# EAGLE schematic teensy (EAGLE 9.6.2)
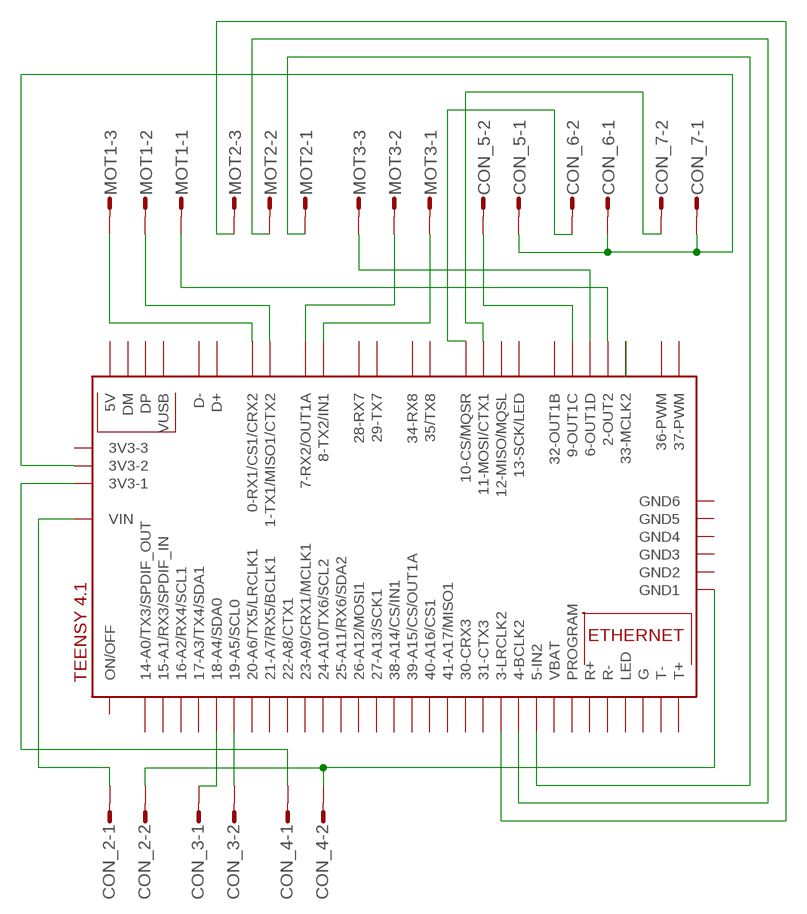
[diagram p0: schematic, sheet 1]

## Parts
CON_2  S02P  [S02P]
CON_3  S02P  [S02P]
CON_4  S02P  [S02P]
CON_5  S02P  [S02P]
CON_6  S02P  [S02P]
CON_7  S02P  [S02P]
MOT1  S03P  [S03P]
MOT2  S03P  [S03P]
MOT3  S03P  [S03P]
U$1  TEENSY41  [TEENSY41]

## Nets
N$1: U$1.33-MCLK2
N$2: CON_2.1 U$1.VIN
N$3: CON_4.1 U$1.3V3-1
N$4: CON_2.2 CON_4.2 U$1.GND1
N$5: CON_5.1 CON_6.1 CON_7.1 U$1.3V3-2
N$6: MOT1.3 U$1.0-RX1/CS1/CRX2
N$7: MOT1.2 U$1.1-TX1/MISO1/CTX2
N$8: MOT1.1 U$1.2-OUT2
N$9: MOT3.2 U$1.7-RX2/OUT1A
N$10: MOT3.1 U$1.8-TX2/IN1
N$11: CON_3.1 U$1.18-A4/SDA0
N$12: CON_3.2 U$1.19-A5/SCL0
N$13: MOT3.3 U$1.6-OUT1D
N$14: CON_5.2 U$1.9-OUT1C
N$15: CON_6.2 U$1.10-CS\MQSR(10-CS/MQSR)
N$16: CON_7.2 U$1.11-MOSI/CTX1
N$17: MOT2.3 U$1.3-LRCLK2
N$18: MOT2.2 U$1.4-BCLK2
N$19: MOT2.1 U$1.5-IN2
Unconnected: U$1.3V3-3 U$1.12-MISO/MQSL U$1.13-SCK/LED U$1.14-A0/TX3/SPDIF_OUT U$1.15-A1/RX3/SPDIF_IN U$1.16-A2/RX4/SCL1 U$1.17-A3/TX4/SDA1 U$1.20-A6/TX5/LRCLK1 U$1.21-A7/RX5/BCLK1 U$1.22-A8/CTX1 U$1.23-A9/CRX1/MCLK1 U$1.24-A10/TX6/SCL2 U$1.25-A11/RX6/SDA2 U$1.26-A12/MOSI1 U$1.27-A13/SCK1 U$1.28-RX7 U$1.29-TX7 U$1.30-CRX3 U$1.31-CTX3 U$1.32-OUT1B U$1.34-RX8 U$1.35-TX8(35/TX8) U$1.36-PWM U$1.37-PWM U$1.38-A14/CS/IN1 U$1.39-A15/CS/OUT1A U$1.40-A16/CS1 U$1.41-A17/MISO1 U$1.+5V(5V) U$1.D+ U$1.D- U$1.DM U$1.DP U$1.G U$1.GND2 U$1.GND3 U$1.GND4 U$1.GND5 U$1.GND6 U$1.LED U$1.ON/OFF U$1.PROGRAM U$1.R+ U$1.R- U$1.T+ U$1.T- U$1.VBAT U$1.VUSB

## Library data of the parts
CON_2-CON_7 = con-amp-mt:S02P: AMP MT CONNECTOR; OC_FARNELL: unknown; OC_NEWARK: unknown
MOT1-MOT3 = con-amp-mt:S03P: AMP MT CONNECTOR; OC_FARNELL: unknown; OC_NEWARK: unknown
U$1 = teensy:TEENSY41